# Altium schematic sheet FUFO.SchDoc
size A
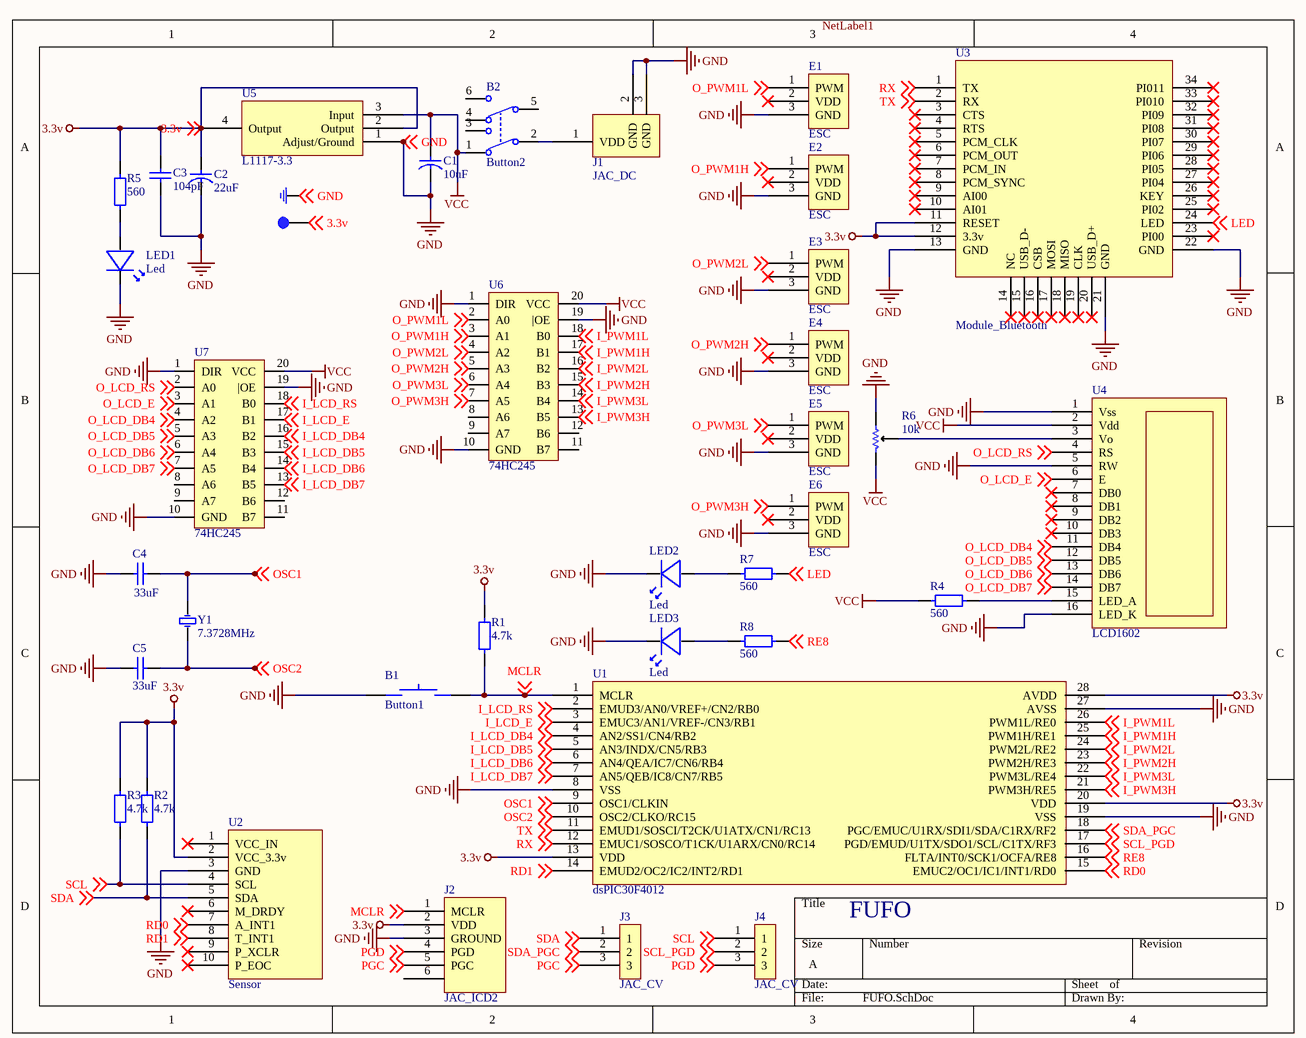
[diagram p0: FUFO.SchDoc]

## Parts
3.3v  3.3v  [3.3v]  (value not drawn)
B1  Button1  [Button1]
B2  Button2  [Button2]
C1  10uF  [Capacitor2]
C2  22uF  [Capacitor3]
C3  104pF  [Capacitor1]
C4  33uF  [Capacitor1]
C5  33uF  [Capacitor1]
E1  ESC  [ESC]
E2  ESC  [ESC]
E3  ESC  [ESC]
E4  ESC  [ESC]
E5  ESC  [ESC]
E6  ESC  [ESC]
GND  GND  [GND]  (value not drawn)
J1  JAC_DC  [Jac_DC]
J2  JAC_ICD2  [JAC_ICD2]
J3  JAC_CV  [JAC_CV]
J4  JAC_CV  [JAC_CV]
LED1  Led  [LED]
LED2  Led  [LED]
LED3  Led  [LED]
R1  4.7k  [Resistor]
R2  4.7k  [Resistor]
R3  4.7k  [Resistor]
R4  560  [Resistor]
R5  560  [Resistor]
R6  10k  [BienTro]
R7  560  [Resistor]
R8  560  [Resistor]
U1  dsPIC30F4012  [dsPIC30F4012]
U2  Sensor  [Sensor]
U3  Module_Bluetooth  [Module_Bluetooth]
U4  LCD1602  [LCD1602]
U5  L1117-3.3  [L1117 - 3.3]
U6  74HC245  [74HC245]
U7  74HC245  [74HC245]
Y1  7.3728MHz  [XTAL]

## Nets
3.3v: 3.3v.0 C2.1 C3.2 J2.2(VDD) R1.2 R2.2 R3.2 R5.2 U1.13(VDD) U1.20(VDD) U1.28(AVDD) U2.2(VCC_3.3v) U3.11(RESET) U3.12(3.3v) U5.2(Output) U5.4(Output) ; off-sheet 3.3v
GND: B1.1 C1.2 C2.2 C3.1 C4.1 C5.1 E1.3(GND) E2.3(GND) E3.3(GND) E4.3(GND) E5.3(GND) E6.3(GND) GND.0 J1.2(GND) J1.3(GND) J2.3(GROUND) LED1.2 LED2.2 LED3.2 R6.0 U1.8(VSS) U1.19(VSS) U1.27(AVSS) U2.3(GND) U3.13(GND) U3.21(GND) U3.22(GND) U4.1(Vss) U4.5(RW) U4.16(LED_K) U5.1(Adjust/Ground) U6.1(DIR) U6.10(GND) U6.19(|OE) U7.1(DIR) U7.10(GND) U7.19(|OE) ; off-sheet GND
VCC: B2.1 C1.1 R4.1 R6.2 U4.2(Vdd) U5.3(Input) U6.20(VCC) U7.20(VCC)
I_LCD_DB4: U1.4(AN2/SS1/CN4/RB2) U7.16(B2) ; off-sheet I_LCD_DB4
I_LCD_DB5: U1.5(AN3/INDX/CN5/RB3) U7.15(B3) ; off-sheet I_LCD_DB5
I_LCD_DB6: U1.6(AN4/QEA/IC7/CN6/RB4) U7.14(B4) ; off-sheet I_LCD_DB6
I_LCD_DB7: U1.7(AN5/QEB/IC8/CN7/RB5) U7.13(B5) ; off-sheet I_LCD_DB7
I_LCD_E: U1.3(EMUC3/AN1/VREF-/CN3/RB1) U7.17(B1) ; off-sheet I_LCD_E
I_LCD_RS: U1.2(EMUD3/AN0/VREF+/CN2/RB0) U7.18(B0) ; off-sheet I_LCD_RS
I_PWM1H: U1.25(PWM1H/RE1) U6.17(B1) ; off-sheet I_PWM1H
I_PWM1L: U1.26(PWM1L/RE0) U6.18(B0) ; off-sheet I_PWM1L
I_PWM2H: U1.23(PWM2H/RE3) U6.15(B3) ; off-sheet I_PWM2H
I_PWM2L: U1.24(PWM2L/RE2) U6.16(B2) ; off-sheet I_PWM2L
I_PWM3H: U1.21(PWM3H/RE5) U6.13(B5) ; off-sheet I_PWM3H
I_PWM3L: U1.22(PWM3L/RE4) U6.14(B4) ; off-sheet I_PWM3L
LED: R7.2 U3.24(LED) ; off-sheet LED
MCLR: B1.2 J2.1(MCLR) R1.1 U1.1(MCLR) ; off-sheet MCLR
O_LCD_DB4: U4.11(DB4) U7.4(A2) ; off-sheet O_LCD_DB4
O_LCD_DB5: U4.12(DB5) U7.5(A3) ; off-sheet O_LCD_DB5
O_LCD_DB6: U4.13(DB6) U7.6(A4) ; off-sheet O_LCD_DB6
O_LCD_DB7: U4.14(DB7) U7.7(A5) ; off-sheet O_LCD_DB7
O_LCD_E: U4.6(E) U7.3(A1) ; off-sheet O_LCD_E
O_LCD_RS: U4.4(RS) U7.2(A0) ; off-sheet O_LCD_RS
O_PWM1H: E2.1(PWM) U6.3(A1) ; off-sheet O_PWM1H
O_PWM1L: E1.1(PWM) U6.2(A0) ; off-sheet O_PWM1L
O_PWM2H: E4.1(PWM) U6.5(A3) ; off-sheet O_PWM2H
O_PWM2L: E3.1(PWM) U6.4(A2) ; off-sheet O_PWM2L
O_PWM3H: E6.1(PWM) U6.7(A5) ; off-sheet O_PWM3H
O_PWM3L: E5.1(PWM) U6.6(A4) ; off-sheet O_PWM3L
OSC1: C4.2 U1.9(OSC1/CLKIN) Y1.2 ; off-sheet OSC1
OSC2: C5.2 U1.10(OSC2/CLKO/RC15) Y1.1 ; off-sheet OSC2
PGC: J2.5(PGC) J3.3 ; off-sheet PGC
PGD: J2.4(PGD) J4.3 ; off-sheet PGD
RD0: U1.15(EMUC2/OC1/IC1/INT1/RD0) U2.7(A_INT1) ; off-sheet RD0
RD1: U1.14(EMUD2/OC2/IC2/INT2/RD1) U2.8(T_INT1) ; off-sheet RD1
RE8: R8.2 U1.16(FLTA/INT0/SCK1/OCFA/RE8) ; off-sheet RE8
RX: U1.12(EMUC1/SOSCO/T1CK/U1ARX/CN0/RC14) U3.1(TX) ; off-sheet RX
SCL: J4.1 R3.1 U2.4(SCL) ; off-sheet SCL
SCL_PGD: J4.2 U1.17(PGD/EMUD/U1TX/SDO1/SCL/C1TX/RF3) ; off-sheet SCL_PGD
SDA: J3.1 R2.1 U2.5(SDA) ; off-sheet SDA
SDA_PGC: J3.2 U1.18(PGC/EMUC/U1RX/SDI1/SDA/C1RX/RF2) ; off-sheet SDA_PGC
TX: U1.11(EMUD1/SOSCI/T2CK/U1ATX/CN1/RC13) U3.2(RX) ; off-sheet TX
NetB2_2: B2.2 J1.1(VDD)
NetLED1_1: LED1.1 R5.1
NetLED2_1: LED2.1 R7.1
NetLED3_1: LED3.1 R8.1
NetR4_2: R4.2 U4.15(LED_A)
NetR6_1: R6.1 U4.3(Vo)

Not connected (* = marked no-connect by the designer): B2 3(5) 4 5 6; E1 2(VDD)*; E2 2(VDD)*; E3 2(VDD)*; E4 2(VDD)*; E5 2(VDD)*; E6 2(VDD)*; J2 6; U2 1(VCC_IN)* 6(M_DRDY)* 9(P_XCLR)* 10(P_EOC)*; U3 3(CTS)* 4(RTS)* 5(PCM_CLK)* 6(PCM_OUT)* 7(PCM_IN)* 8(PCM_SYNC)* 9(AI00)* 10(AI01)* 14(NC)* 15(USB_D-)* 16(CSB)* 17(MOSI)* 18(MISO)* 19(CLK)* 20(USB_D+)* 23(PI00)* 25(PI02)* 26(KEY)* 27(PI04)* 28(PI05)* 29(PI06)* 30(PI07)* 31(PI08)* 32(PI09)* 33(PI010)* 34(PI011)*; U4 7(DB0)* 8(DB1)* 9(DB2)* 10(DB3)*; U6 8(A6) 9(A7) 11(B7) 12(B6); U7 8(A6) 9(A7) 11(B7) 12(B6)

## Notes on the sheet
- (near U1) FUFO
- Labels drawn without touching a wire or pin: NetLabel1

## Library data of the parts
C1 = Capacitor2
C2 = Capacitor3
C3-C5 = Capacitor1
R1-R5 R7 R8 = Resistor
R6 = BienTro
Y1 = XTAL